# Altium schematic sheet PIR_Sensor.SchDoc: PIR_Sensor
size A3; Date: 1402/05/09; CheckedBy: Hamid_Jafari; CompanyName: BasirAndishan; DrawnBy: Amirreza Salehpour; Revision: 1.3.0; SheetNumber: 1; SheetTotal: 1
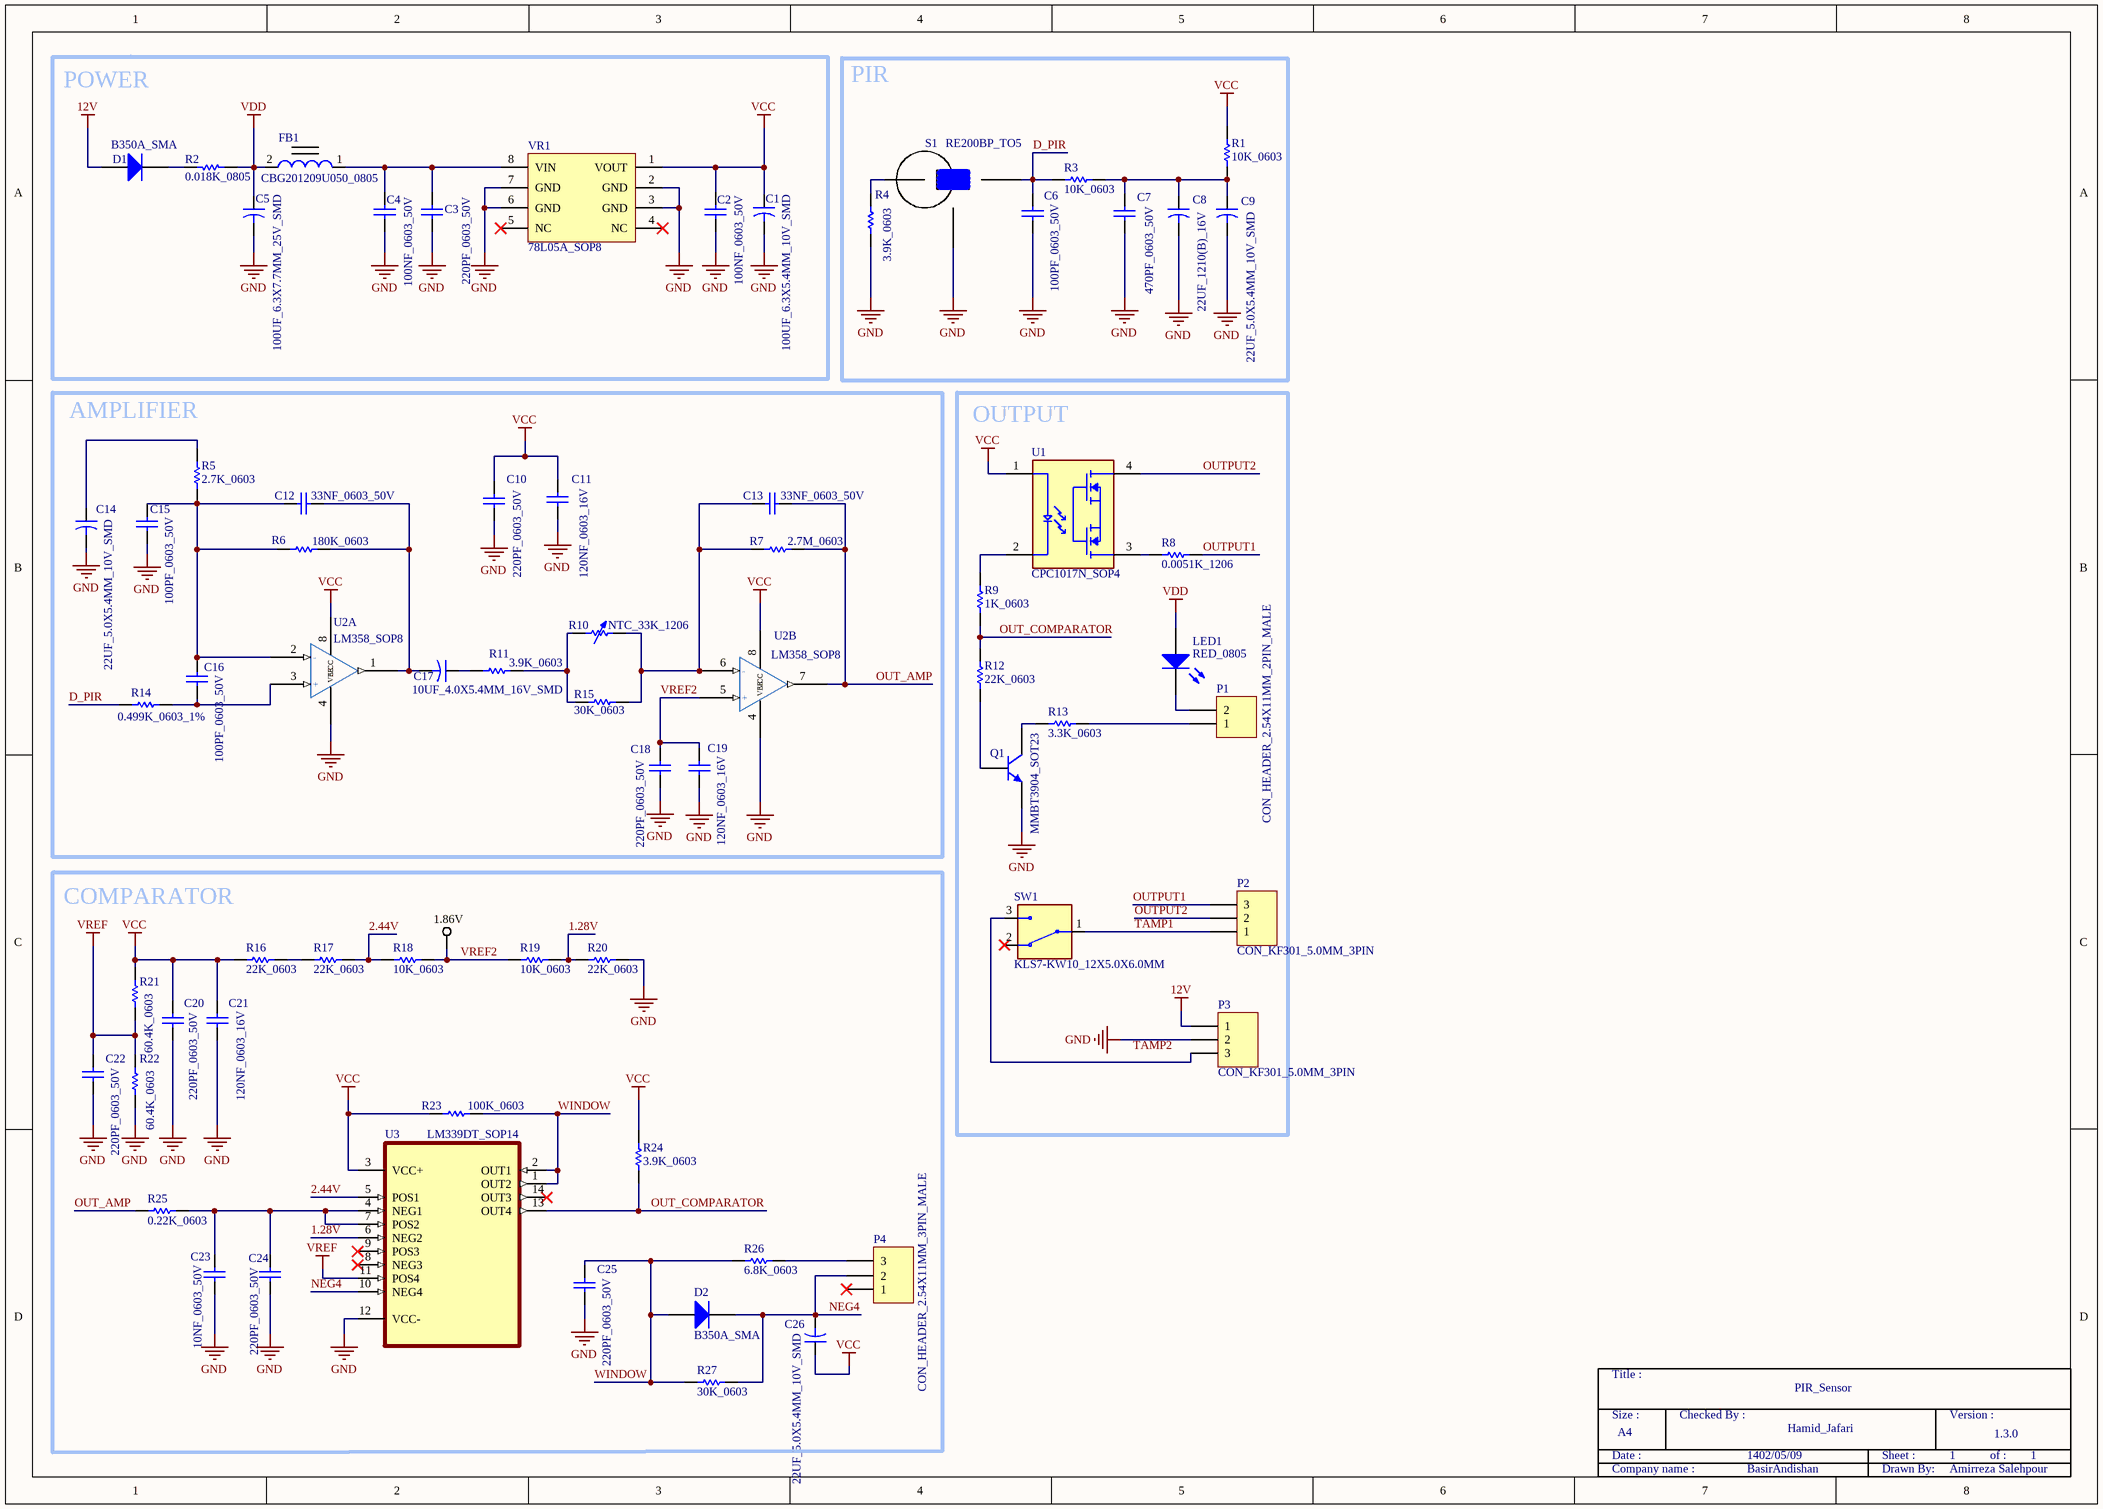
[diagram p0: PIR_Sensor.SchDoc]

## Parts
1.86V  TESTPOINT_SMD  [TPSMD_C1]  (value not drawn)  (net tie, no BOM)
C1  100UF_6.3X5.4MM_10V_SMD  [CAP_EL_SMD_6X8]
C2  100NF_0603_50V  [Cap_0603_Nominal]
C3  220PF_0603_50V  [Cap_0603_Nominal]
C4  100NF_0603_50V  [Cap_0603_Nominal]
C5  100UF_6.3X7.7MM_25V_SMD  [CAP_EL_SMD_6X8]
C6  100PF_0603_50V  [Cap_0603_Nominal]
C7  470PF_0603_50V  [Cap_0603_Nominal]
C8  22UF_1210(B)_16V  [Cap_Tantal(3528)_B]
C9  22UF_5.0X5.4MM_10V_SMD  [CAP_EL_SMD_5]
C10  220PF_0603_50V  [Cap_0603_Nominal]
C11  120NF_0603_16V  [Cap_0603_Nominal]
C12  33NF_0603_50V  [Cap_0603_Nominal]
C13  33NF_0603_50V  [Cap_0603_Nominal]
C14  22UF_5.0X5.4MM_10V_SMD  [CAP_EL_SMD_5]
C15  100PF_0603_50V  [Cap_0603_Nominal]
C16  100PF_0603_50V  [Cap_0603_Nominal]
C17  10UF_4.0X5.4MM_16V_SMD  [CAP_EL_SMD_4]
C18  220PF_0603_50V  [Cap_0603_Nominal]
C19  120NF_0603_16V  [Cap_0603_Nominal]
C20  220PF_0603_50V  [Cap_0603_Nominal]
C21  120NF_0603_16V  [Cap_0603_Nominal]
C22  220PF_0603_50V  [Cap_0603_Nominal]
C23  10NF_0603_50V  [Cap_0603_Nominal]
C24  220PF_0603_50V  [Cap_0603_Nominal]
C25  220PF_0603_50V  [Cap_0603_Nominal]
C26  22UF_5.0X5.4MM_10V_SMD  [CAP_EL_SMD_5]
D1  B350A_SMA  [DIODE_SMA]
D2  B350A_SMA  [DIODE_SMA]
FB1  CBG201209U050_0805  [INDUCTOR_0805_Nominal]
LED1  RED_0805  [LED_0805_NOMINAL]
P1  CON_HEADER_2.54X11MM_2PIN_MALE  [HDR_M_1X2_2.54mm]
P2  CON_KF301_5.0MM_3PIN  [CON_KF301_5MM_3PIN]
P3  CON_KF301_5.0MM_3PIN  [CON_KF301_5MM_3PIN]
P4  CON_HEADER_2.54X11MM_3PIN_MALE  [HDR_M_1X3_2.54mm]
Q1  MMBT3904_SOT23  [SOT23_BJT]
R1  10K_0603  [Res_0603_Nominal]
R2  0.018K_0805  [Res_0805_Nominal]
R3  10K_0603  [Res_0603_Nominal]
R4  3.9K_0603  [Res_0603_Nominal]
R5  2.7K_0603  [Res_0603_Nominal]
R6  180K_0603  [Res_0603_Nominal]
R7  2.7M_0603  [Res_0603_Nominal]
R8  0.0051K_1206  [Res_1206_NOMINAL]
R9  1K_0603  [Res_0603_Nominal]
R10  NTC_33K_1206  [Res_1206_NOMINAL]
R11  3.9K_0603  [Res_0603_Nominal]
R12  22K_0603  [Res_0603_Nominal]
R13  3.3K_0603  [Res_0603_Nominal]
R14  0.499K_0603_1%  [Res_0603_Nominal]
R15  30K_0603  [Res_0603_Nominal]
R16  22K_0603  [Res_0603_Nominal]
R17  22K_0603  [Res_0603_Nominal]
R18  10K_0603  [Res_0603_Nominal]
R19  10K_0603  [Res_0603_Nominal]
R20  22K_0603  [Res_0603_Nominal]
R21  60.4K_0603  [Res_0603_Nominal]
R22  60.4K_0603  [Res_0603_Nominal]
R23  100K_0603  [Res_0603_Nominal]
R24  3.9K_0603  [Res_0603_Nominal]
R25  0.22K_0603  [Res_0603_Nominal]
R26  6.8K_0603  [Res_0603_Nominal]
R27  30K_0603  [Res_0603_Nominal]
S1  RE200BP_TO5  [SENSOR_PIR_TO39]
SW1  KLS7-KW10_12X5.0X6.0MM  [SW_KLS7-KW10]
U1  CPC1017N_SOP4  [SOIC254P610X218-4N]
U2  LM358_SOP8  [SOIC8]  (parts A,B of 2)
U3  LM339DT_SOP14  [SO_14]
VR1  78L05A_SOP8  [SOP8]

## Blocks framed on the sheet
POWER: C1-C5 D1 FB1 R2 VR1
PIR: C6-C9 R1 R3 R4 S1
AMPLIFIER: C10-C19 R5-R7 R10 R11 R14 R15 U2
OUTPUT: LED1 P1-P3 Q1 R8 R9 R12 R13 SW1 U1
COMPARATOR: 1.86V C20-C26 D2 P4 R16-R27 U3

## Nets
12V: D1.1(A) P3.1
GND: C1.2 C2.1 C3.1 C4.1 C5.2 C6.1 C7.1 C8.2 C9.2 C10.1 C11.1 C14.2 C15.2 C18.1 C19.1 C20.1 C21.1 C22.1 C23.1 C24.1 C25.2 P3.2 Q1.2(E) R4.1 R20.2 R22.2 S1.3 U2.4(VEE) U3.12(VCC-) VR1.2(GND) VR1.3(GND) VR1.6(GND) VR1.7(GND)
VCC: C1.1 C2.2 C10.2 C11.2 C20.2 C21.2 C26.1 R1.2 R16.2 R21.1 R23.2 R24.1 U1.1(+CONTROL) U2.8(VCC) U3.3(VCC+) VR1.1(VOUT)
VDD: C5.1 FB1.2 LED1.1(A) R2.1
VREF: C22.2 R21.2 R22.1 U3.11(POS4)
1.28V: R19.2 R20.1 U3.6(NEG2)
2.44V: R17.1 R18.1 U3.5(POS1)
D_PIR: C6.2 R3.2 R14.2 S1.1
NEG4: C26.2 D2.2(K) P4.2 R27.2 U3.10(NEG4)
OUT_AMP: C13.1 R7.1 R25.2 U2.7(OUT)
OUT_COMPARATOR: R9.1 R12.2 R24.2 U3.13(OUT4)
OUTPUT1: P2.3 R8.2
OUTPUT2: P2.2 U1.4(LOAD2)
TAMP1: P2.1 SW1.1(COM)
VREF2: 1.86V.1 C18.2 C19.2 R18.2 R19.1 U2.5(+)
WINDOW: C25.1 D2.1(A) R23.1 R26.1 R27.1 U3.1(OUT2) U3.2(OUT1)
NetC3_2: C3.2 C4.2 FB1.1 VR1.8(VIN)
NetC7_2: C7.2 C8.1 C9.1 R1.1 R3.1
NetC12_1: C12.1 C17.2 R6.1 U2.1(OUT)
NetC12_2: C12.2 C15.1 C16.2 R5.1 R6.2 U2.2(-)
NetC13_2: C13.2 R7.2 R10.2 R15.1 U2.6(-)
NetC14_1: C14.1 R5.2
NetC16_1: C16.1 R14.1 U2.3(+)
NetC17_1: C17.1 R11.2
NetC23_2: C23.2 C24.2 R25.1 U3.4(NEG1) U3.7(POS2)
NetD1_2: D1.2(K) R2.2
NetLED1_2: LED1.2(K) P1.2
NetP1_1: P1.1 R13.1
NetP3_3: P3.3 SW1.3(NO)
NetP4_3: P4.3 R26.2
NetQ1_1: Q1.1(B) R12.1
NetQ1_3: Q1.3(C) R13.2
NetR4_2: R4.2 S1.2
NetR8_1: R8.1 U1.3(LOAD1)
NetR9_2: R9.2 U1.2(-CONTROL)
NetR10_1: R10.1 R11.1 R15.2
NetR16_1: R16.1 R17.2

Not connected (* = marked no-connect by the designer): P4 1*; SW1 2(NC)*; U3 8(NEG3)* 9(POS3)* 14(OUT3)*; VR1 4(NC)* 5(NC)*

## Notes on the sheet
- Title :
- Date :
- Size :
- A4
- Checked By :
- Sheet :
- Version :
- of :
- Company name :
- Drawn By:
- Labels drawn without touching a wire or pin: TAMP2

## Library data of the parts
1.86V = TESTPOINT_SMD: TEST POINT; MANF: MANF; MANF_P#: MANF_P#; VALUE: VALUE
C1 = Cap_Electrical: value: 100UF_10V_5*5.8
C2 C4 = Cap: 0603; Component ID: 000400; value: 100nF_0603_50V
C3 = Cap: 0603; value: 100nF_0603_50V
C5 = Cap_Electrical: value: 100UF_25V_5*5.8
C6 C15 C16 = Cap: 0603; value: 100PF_0603_50V
C7 = Cap: 0603; Component ID: 002055; value: 470PF_0603_50V
C8 = Cap_Electrical: Tant; value: 22UF_16V_B
C9 C14 C17 C26 = Cap_Electrical: value: 22UF_10V_5*5.8
C10-C13 C18-C22 C24 C25 = Cap: 0603; value: 100PF_0603_50V
C23 = Cap: 0603; value: 100PF_0603_50V; Component ID: 002440
D1 D2 = Diode: B350A; value: *
FB1 = FERRITE BEAD: value: MU1608-221Y
LED1 = LED: Component ID: 000517
P1 = Header 2: Header, 2-Pin; LatestRevisionDate: 17-Jul-2002; LatestRevisionNote: Re-released for DXP Platform.; Publisher: Altium Limited
P2 P3 = Con_3PIN
P4 = Header 3: Header,3-Pin; value: KF301; LatestRevisionDate: 17-Jul-2002; LatestRevisionNote: Re-released for DXP Platform.; Publisher: Altium Limited
Q1 = MMBT3904: Component ID: 000489
R1 R3 = RES: 0603; Component ID: 000091; value: 10k_0603; size: 0603
R2 = RES: 0805; value: 18_0603; size: 0805
R4 = RES: 0603; value: 3.9K_0603; size: 0603
R5 = RES: 0603; value: 18_0603; Component ID: 000150; size: 0603
R6-R8 R11 R14 R21 R22 R24 R26 R27 = RES: 0603; value: 18_0603; size: 0603
R9 = RES: 0603; value: 18_0603; Component ID: 000095; size: 0603
R10 = Res Adj1: Variable Resistor; Value: 1K; Set Position: 0.5; Published: 8-Jun-2000; LatestRevisionDate: 17-Jul-2002; LatestRevisionNote: Re-released for DXP Platform.; PackageReference: AXIAL-0.7; Publisher: Altium Limited; PackageDescription: Axial Device, Thru-Hole; 2 Leads; 0.7 in Pin Spacing
R12 R16 R17 R20 = RES: 0603; value: 18_0603; Component ID: 000110; size: 0603
R13 = RES: 0603; value: 18_0603; Component ID: 000154; size: 0603
R15 = RES: 0603; value: 18_0603; Component ID: 000153; size: 0603
R18 R19 = RES: 0603; value: 18_0603; Component ID: 000091; size: 0603
R23 = RES: 0603; value: 18_0603; Component ID: 003179; size: 0603
R25 = RES: 0603; value: 18_0603; Component ID: 000140; size: 0603
S1 = PIR_Sensor: Component ID: 000635
SW1 = Micro switch: SWITCH SNAP ACTION SPDT 2A 125V; MF: E-Switch; MP: MS0850502F030P1A; Package: None; Value: *; Availability: Unavailable; SnapEDA_Link: https://www.snapeda.com/parts/MS0850502F030P1A/E-Switch/view-part/1129959/?ref=snap; Price: None
U1 = CPC1017N: Solid State SPST-NO _1 Form A_ 4-SOP _0.150, 3.81mm_; MF: IXYS Integrated; Package: SOP-4 IXYS; MP: CPC1017N; SnapEDA_Link: https://www.snapeda.com/parts/CPC1017N/IXYS%20Integrated%20Circuits%20Division/view-part/345722/?ref=snap; Value: *; Availability: Unavailable; Price: None
U2 = LM358: Component ID: 001792
U3 = LM339DT: LM339 Series Quad 32 V 250 nA SMT Low Power Voltage Comparator - SOIC-14; MF: STMicroelectronics; Component ID: 001788; Price: None; Value: *; Package: SOIC-14 STMicroelectronics; Availability: Unavailable; SnapEDA_Link: https://www.snapeda.com/parts/LM339DT/STMicroelectronics/view-part/11706/?ref=snap; MP: LM339DT
VR1 = 78L05A: Component ID: 001298